# EAGLE design g_Switched_Cap_BC (EAGLE 9.2.1)
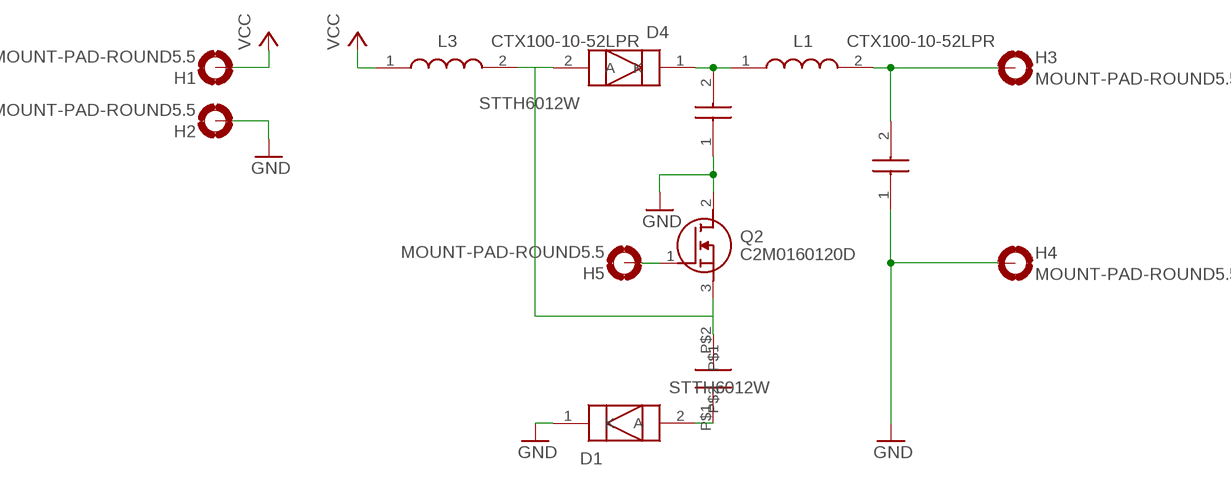
[diagram p0: schematic, sheet 1]

## Parts
C1  B32774D4505K000  [B32774D4505K000]
C2  PH_B32774D4505K000PLACEHOLDER  [TJ4-U1]
C3  B32774D4505K000  [B32774D4505K000]
D1  STTH6012W  [TO1090P515X1560X2445-2P]
D4  STTH6012W  [TO1090P515X1560X2445-2P]
H1  MOUNT-PAD-ROUND5.5  [5,5-PAD]
H2  MOUNT-PAD-ROUND5.5  [5,5-PAD]
H3  MOUNT-PAD-ROUND5.5  [5,5-PAD]
H4  MOUNT-PAD-ROUND5.5  [5,5-PAD]
H5  MOUNT-PAD-ROUND5.5  [5,5-PAD]
L1  CTX100-10-52LPR  [CTX1001052LPR]
L3  CTX100-10-52LPR  [CTX1001052LPR]
Q2  C2M0160120D  [TO544P521X1594X2550-3P]

## Nets
GND: C1.1 C3.1 D1.1(K) H2.B5,5(MOUNT) H4.B5,5(MOUNT) Q2.2(D)
N$1: C2.P$2 D4.2(A) L3.2 Q2.3(S)
N$3: C2.P$1 D1.2(A)
N$4: H5.B5,5(MOUNT) Q2.1(G)
N$5: C3.2 H3.B5,5(MOUNT) L1.2
N$6: C1.2 D4.1(K) L1.1
VCC: H1.B5,5(MOUNT) L3.1

## Library data of the parts
C1 C3 = SamacSys_Parts:B32774D4505K000: Epcos B32774D 5F Polypropylene Film Capacitor 450 V dc 10% Source: Datasheet <https://en.tdk-electronics.tdk.com/inf/20/20/db/fc_2009/MKP_B32774_778.pdf>; ARROW_PART_NUMBER: B32774D4505K000; ARROW_PRICE-STOCK: https://www.arrow.com/en/products/b32774d4505k000/epcos-tdk; DESCRIPTION: Epcos B32774D 5F Polypropylene Film Capacitor 450 V dc 10%; HEIGHT: 21mm; MANUFACTURER_NAME: EPCOS; MANUFACTURER_PART_NUMBER: B32774D4505K000; RS_PART_NUMBER: 1726009; RS_PRICE-STOCK: http://uk.rs-online.com/web/p/products/1726009
C2 = placeholders:PH_B32774D4505K000
D1 D4 = SamacSys_Parts:STTH6012W: STTH6012W, Fast Recovery Rectifier Diode, Switching 60A max, 1200V 125ns, 2-Pin, DO-247 Source: Datasheet <http://www.st.com/web/en/resource/technical/document/datasheet/CD00096472.pdf>; ALLIED_NUMBER: 70014108; ALLIED_PRICE-STOCK: http://www.alliedelec.com/stmicroelectronics-stth6012w/70014108/; ARROW_PART_NUMBER: STTH6012W; ARROW_PRICE-STOCK: https://www.arrow.com/en/products/stth6012w/stmicroelectronics; DESCRIPTION: STTH6012W, Fast Recovery Rectifier Diode, Switching 60A max, 1200V 125ns, 2-Pin, DO-247; HEIGHT: 5.15mm; MANUFACTURER_NAME: STMicroelectronics; MANUFACTURER_PART_NUMBER: STTH6012W; RS_PART_NUMBER: 6870818; RS_PRICE-STOCK: http://uk.rs-online.com/web/p/rectifier-schottky-diodes/6870818/?source=DS
H1-H5 = holes:MOUNT-PAD-ROUND: MOUNTING PAD, round
L1 L3 = SamacSys_Parts:CTX100-10-52LPR: Fixed Inductors 100uH 13A Source: Datasheet <http://www.cooperindustries.com/content/dam/public/bussmann/Electronics/Resources/product-datasheets/Bus_Elx_DS_PM 4304_LPCI_Series.pdf>; ARROW_PART_NUMBER: CTX100-10-52LPR; DESCRIPTION: Fixed Inductors 100uH 13A; HEIGHT: 27.5mm; MANUFACTURER_NAME: Eaton; MANUFACTURER_PART_NUMBER: CTX100-10-52LPR
Q2 = SamacSys_Parts:C2M0160120D: Wolfspeed C2M0160120D N-channel SiC MOSFET Transistor, 19 A, 1200 V, 3-Pin TO-247 Source: Datasheet <http://www.wolfspeed.com/media/downloads/169/C2M0160120D.pdf>; ARROW_PART_NUMBER: C2M0160120D; ARROW_PRICE-STOCK: http://uk.rs-online.com/web/p/products/1629709; DESCRIPTION: Wolfspeed C2M0160120D N-channel SiC MOSFET Transistor, 19 A, 1200 V, 3-Pin TO-247; HEIGHT: 5.21mm; MANUFACTURER_NAME: Wolfspeed; MANUFACTURER_PART_NUMBER: C2M0160120D; RS_PART_NUMBER: 1629709; RS_PRICE-STOCK: http://uk.rs-online.com/web/p/products/1629709

## Board
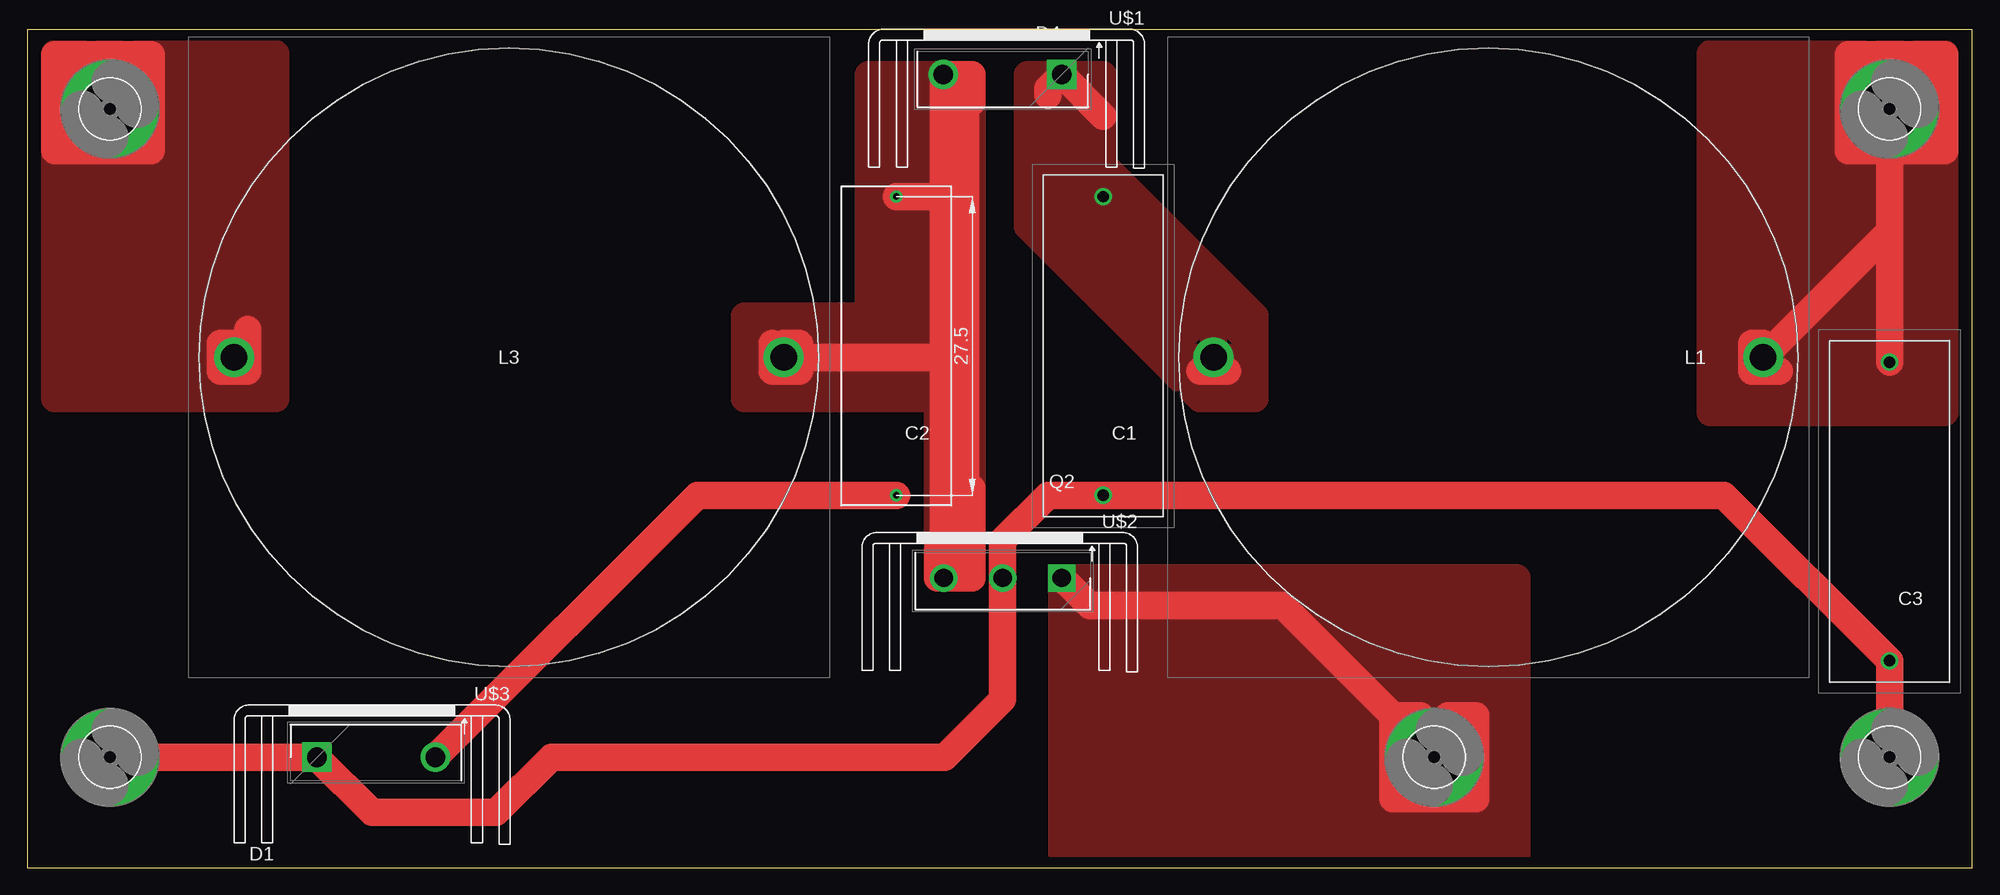
[diagram p1: board, top side]

Size 179.05 x 77.14 mm. Coordinates in mm from the lower left corner, seen from the top.
Outline: 0,0 179.05,0 179.05,77.14 0,77.14 0,0
Copper layers (1*16): Top 0.035mm / dielectric 1.5mm / Bottom 0.035mm
Design rules "default": minimum track width 6mil, minimum drill 0.35mm, track to track 6mil, track to pad 6mil, pad to pad 6mil, via to via 6mil, smd to smd 6mil, copper to edge 40mil, drill to drill 6mil, minimum pad ring 10mil, minimum via ring 8mil, stop-mask expansion 4mil, vias tented up to drill 0mil, thermal gap 10mil

### Footprints (pad centres in the part's own frame; a part is rotated, then mirrored left to right if it is on the bottom)
B32774D4505K000 = drill 1.05 pad 1.575: 1 0,0; 2 27.5,0
TJ4-U1 = drill 0.6: P$1 0,0; P$2 27.5,0
TO1090P515X1560X2445-2P = drill 1.81 pad 2.715 square: 1 0,0 | drill 1.81 pad 2.715: 2 10.9,0
5,5-PAD = drill 5.5 pad 9: B5,5 0,0
CTX1001052LPR = drill 2.45 pad 3.675: 1 0,0; 2 50.6,0
TO544P521X1594X2550-3P = drill 1.69 pad 2.535 square: 1 0,0 | drill 1.69 pad 2.535: 2 5.44,0; 3 10.88,0

### Placement (x,y rotation side)
C1  99.06,34.29 90 top
C2  80.01,34.29 90 top
C3  171.45,19.05 90 top
D1  26.67,10.16 0 top
D4  95.25,73.03 180 top
H1  7.62,69.85 0 top
H2  7.62,10.16 0 top
H3  171.45,69.85 0 top
H4  171.45,10.16 0 top
H5  129.54,10.16 0 top
L1  109.22,46.99 0 top
L3  19.05,46.99 0 top
Q2  95.25,26.67 180 top
U$1  [FK213]  90.17,76.2 180 top
U$2  [FK213]  89.53,29.84 180 top
U$3  [FK213]  31.75,13.97 180 top

### Tracks (layer width: path | path; a pad name or v marks a point on that pad's centre or on a via)
GND
  Top 2.54: H4.B5,5 C3.1 156.21,34.29 C1.1 93.98,34.29 89.81,30.12 Q2.2 89.81,15.52 84.45,10.16 48.26,10.16 43.18,5.08 31.75,5.08 D1.1 H2.B5,5
N$1
  Top 2.54: D4.2 84.35,60.96 | 84.35,60.96 84.35,46.99 | 84.35,46.99 84.35,26.69 Q2.3 | 84.35,46.99 L3.2 69.65,48.26 71.12,48.26 71.12,45.72 68.58,45.72 68.58,48.26 | C2.P$2 83.52,61.79 84.35,60.96 | Q2.3 86.36,28.66 86.36,71.02 D4.2 | Q2.3 87,26.67 87,34.92 | Q2.3 83.82,26.67 83.82,29.21 | D4.2 87,73.03 87,70.48
  pour Top: 87,73.03 87,26.67 83.82,26.67 83.82,43.18 66.04,43.18 66.04,50.8 77.47,50.8 77.47,73.03
N$3
  Top 2.54: D1.2 61.7,34.29 C2.P$1
N$4
  Top 2.54: Q2.1 97.79,24.13 115.57,24.13 H5.B5,5 128.27,10.16 128.27,13.97 127,13.97 | 127,13.97 125.73,13.97 125.73,6.35 133.35,6.35 133.35,13.97 130.81,13.97 130.81,7.62 127,7.62 127,13.97
  pour Top: 95.25,26.67 137.16,26.67 137.16,1.27 95.25,1.27
N$5
  Top 2.54: C3.2 H3.B5,5 | H3.B5,5 171.45,58.62 L1.2 159.82,48.26 158.75,48.26 158.75,45.72 161.29,45.72 | H3.B5,5 171.45,74.85 176.53,74.85 176.53,66.04 167.64,66.04 167.64,74.85 173.99,74.85 173.99,72.39 | 173.99,67.31 173.99,72.39 | 173.99,72.39 168.91,72.39 | H3.B5,5 170.18,69.85 170.18,67.31
  pour Top: 154.94,74.93 176.53,74.93 176.53,41.91 154.94,41.91
N$6
  Top 2.54: 99.06,69.22 D4.1 93.98,71.75 93.98,71.12 | L1.1 107.95,45.72 110.49,45.72
  pour Top: 92.08,73.03 92.08,59.05 107.95,43.18 113.03,43.18 113.03,50.8 99.06,64.77 99.06,73.03
VCC
  Top 2.54: H1.B5,5 7.62,74.85 | 10.16,74.85 11.43,74.85 11.43,66.04 2.54,66.04 2.54,74.85 7.62,74.85 | 7.62,74.85 10.16,74.85 | 10.16,74.85 10.16,67.31 5.08,67.31 5.08,73.66 | L3.1 19.05,48.26 17.78,48.26 17.78,45.72 20.32,45.72 20.32,49.53
  pour Top: 2.54,74.93 22.86,74.93 22.86,43.18 2.54,43.18